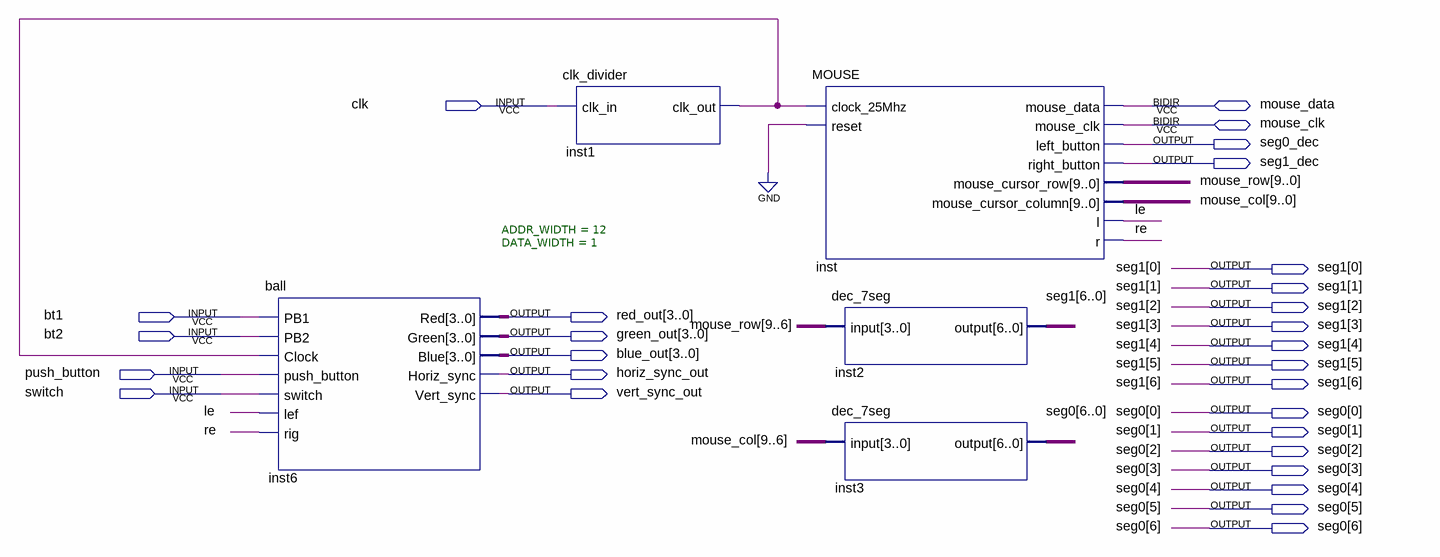
[diagram p0: schematic sheet]
// Quartus schematic Block_Mouse.bdf as structural Verilog: 5 symbols, 28 pins
module Block_Mouse (
  input  clk,
  input  bt1,
  input  bt2,
  input  push_button,
  input  switch,
  inout  mouse_data,
  inout  mouse_clk,
  output seg0_dec,
  output seg1_dec,
  output [6:0] seg1,
  output [3:0] red_out,
  output [3:0] green_out,
  output [3:0] blue_out,
  output horiz_sync_out,
  output vert_sync_out,
  output [6:0] seg0
);

  wire inst1_clk_out, le, re;
  wire [9:0] mouse_col, mouse_row;

  ball #(.ADDR_WIDTH(12), .DATA_WIDTH(1)) inst6 (
    .PB1(bt1), .PB2(bt2), .Clock(inst1_clk_out), .push_button(push_button), .switch(switch), .lef(le),
    .rig(re), .Red(red_out), .Green(green_out), .Blue(blue_out), .Horiz_sync(horiz_sync_out),
    .Vert_sync(vert_sync_out));
  clk_divider inst1 (.clk_in(clk), .clk_out(inst1_clk_out));
  MOUSE inst (
    .clock_25Mhz(inst1_clk_out), .reset(1'b0), .left_button(seg0_dec), .right_button(seg1_dec),
    .mouse_cursor_row(mouse_row), .mouse_cursor_column(mouse_col), .l(le), .r(re), .mouse_data(mouse_data),
    .mouse_clk(mouse_clk));
  dec_7seg inst2 (.\input (mouse_row[9:6]), .\output (seg1));
  dec_7seg inst3 (.\input (mouse_col[9:6]), .\output (seg0));
endmodule
